# EAGLE design light_45 (EAGLE 7.6.0)
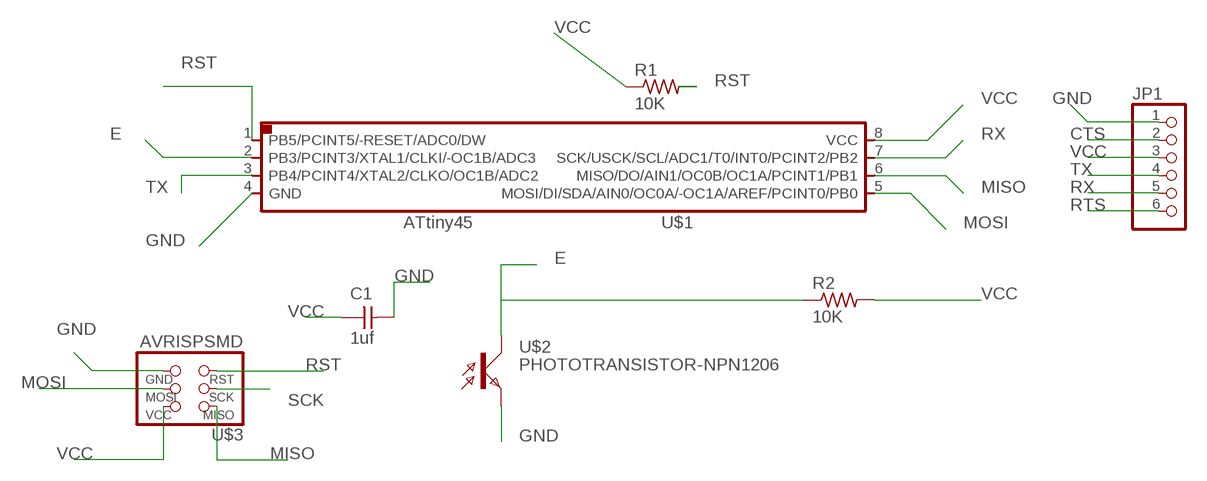
[diagram p0: schematic, sheet 1]

## Parts
C1  1uf  UNPOLARIZED_CAPACITOR1206  [1206]
JP1  PINHD-1X6B  [1X06-BIG]
R1  10K  RES-US1206FAB  [R1206FAB]
R2  10K  RES-US1206FAB  [R1206FAB]
U$1  ATTINY45SI  [SOIC8]
U$2  PHOTOTRANSISTOR-NPN1206  [OP1206]
U$3  AVRISPSMD  [2X03SMD]

## Nets
CTS: JP1.2
E: R2.1 U$1.2(PB3/PCINT3/XTAL1/CLKI/-OC1B/ADC3) U$2.COLLECTOR(C)
GND: C1.2 JP1.1 U$1.4(GND) U$2.EMITTER(E) U$3.6(GND)
MISO: U$1.6(MISO/DO/AIN1/OC0B/OC1A/PCINT1/PB1) U$3.1(MISO)
MOSI: U$1.5(MOSI/DI/SDA/AIN0/OC0A/-OC1A/AREF/PCINT0/PB0) U$3.4(MOSI)
RST: R1.2 U$1.1(PB5/PCINT5/-RESET/ADC0/DW) U$3.5(RST)
RTS: JP1.6
RX: JP1.5 U$1.7(SCK/USCK/SCL/ADC1/T0/INT0/PCINT2/PB2)
SCK: U$3.3(SCK)
TX: JP1.4 U$1.3(PB4/PCINT4/XTAL2/CLKO/OC1B/ADC2)
VCC: C1.1 JP1.3 R1.1 R2.2 U$1.8(VCC) U$3.2(VCC)

## Library data of the parts
C1 = 01_FAB_Hello:UNPOLARIZED_CAPACITOR: unpolarized_capacitor
JP1 = 01_adafruit:PINHD-1X6: PIN HEADER
R1 R2 = fab:RES-US: Resistor (US Symbol) Variants with postfix FAB are widened to allow the routing of internal traces
U$1 = 01_fab:ATTINY45
U$2 = 01_fab:PHOTOTRANSISTOR-NPN
U$3 = 01_fab:AVRISP

## Net classes
0 default: width 0.15 mm, clearance 0.5 mm

## Board
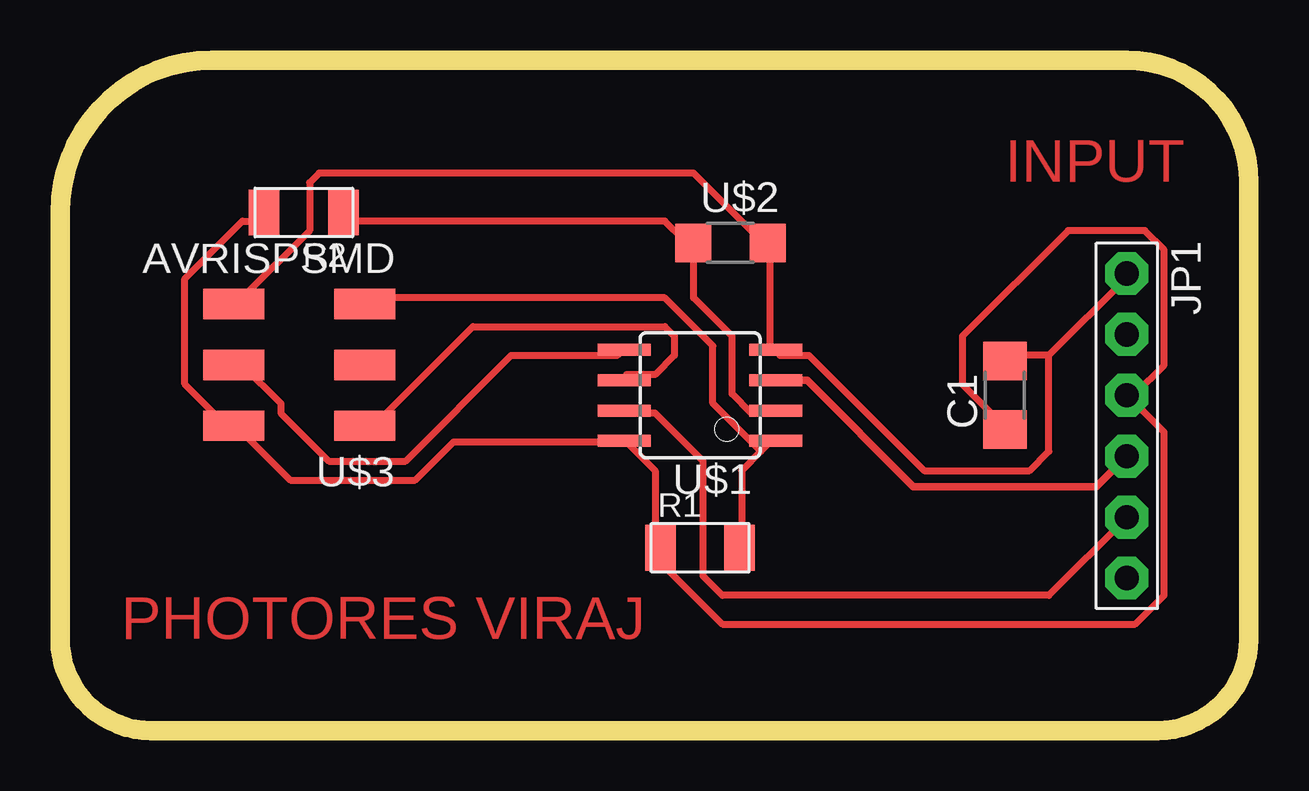
[diagram p1: board, top side]

Size 49.53 x 27.94 mm. Coordinates in mm from the lower left corner, seen from the top.
Outline: 0,21.59 arc-90 6.35,27.94 44.45,27.94 arc-90 49.53,22.86 49.53,3.81 arc-90 45.72,0 3.81,0 arc-90 0,3.81 0,21.59
Copper layers (1*16): Top 0.035mm / dielectric 1.5mm / Bottom 0.035mm
Design rules "fab": minimum track width 0.3mm, minimum drill 32mil, track to track 0.315mm, track to pad 0.315mm, pad to pad 0.315mm, via to via 0.315mm, smd to smd 0.315mm, copper to edge 40mil, drill to drill 16mil, minimum pad ring 10mil, minimum via ring 8mil, stop-mask expansion 4mil, vias tented up to drill 0mil, thermal gap 10mil

### Footprints (pad centres in the part's own frame; a part is rotated, then mirrored left to right if it is on the bottom)
1206 = smd 1.6 x 1.803: 1 -1.422,0; 2 1.422,0
1X06-BIG = drill 1.016 pad 1.778 octagon: 1 -6.35,0; 2 -3.81,0; 3 -1.27,0; 4 1.27,0; 5 3.81,0; 6 6.35,0
R1206FAB = smd 1.27 x 1.905: 1 -1.651,0; 2 1.651,0
SOIC8 = smd 0.5 x 2.2: 1 -1.905,-3.154; 2 -0.645,-3.154; 3 0.625,-3.154; 4 1.895,-3.154; 5 1.905,3.154; 6 0.635,3.154; 7 -0.635,3.154; 8 -1.905,3.154
OP1206 = smd 1.5 x 1.6: COLLECTOR -1.55,0; EMITTER 1.55,0
2X03SMD = smd 2.54 x 1.27: 1 -2.54,2.54; 2 2.92,2.54; 3 -2.54,0; 4 2.92,0; 5 -2.54,-2.54; 6 2.92,-2.54

### Placement (x,y rotation side)
C1  39.37,13.97 90 top
JP1  44.45,12.7 270 top
R1  26.67,7.62 0 top
R2  10.16,21.59 180 top
U$1  26.67,13.97 90 top
U$2  27.94,20.32 0 top
U$3  10.16,15.24 180 top

### Tracks (layer width: path | path; a pad name or v marks a point on that pad's centre or on a via)
E
  Top 0.3: U$1.2 29.6,13.23 28.8,13.23 28,14.03 28,16.43 26.4,18.03 26.4,20.03 U$2.COLLECTOR 26,20.43 25.2,21.23 12,21.23 R2.1
GND
  Top 0.3: 41.2,15.63 39.6,15.63 C1.2 | 41.2,15.63 44.4,18.83 JP1.1 | U$3.6 7.6,18.03 10.4,20.83 10.4,22.83 10.8,23.23 26.4,23.23 29.2,20.43 U$2.EMITTER 29.6,20.03 29.6,16.03 U$1.4 30,15.63 31.2,15.63 36,10.83 40.4,10.83 41.2,11.63 41.2,15.63
MISO
  Top 0.3: U$1.6 23.6,14.83 24.8,14.83 25.6,15.63 25.6,16.43 25.2,16.83 17.2,16.83 12.8,12.43 U$3.1
MOSI
  Top 0.3: U$1.5 23.2,15.63 18.8,15.63 14.4,11.23 11.2,11.23 9.2,13.23 9.2,13.63 7.6,15.23 U$3.4
RST
  Top 0.3: 29.2,11.63 29.6,12.03 U$1.1 | 29.2,11.63 28.4,10.83 28.4,7.63 R1.2 | 29.2,11.63 27.2,13.63 27.2,16.03 25.2,18.03 12.8,18.03 U$3.5
RX
  Top 0.3: U$1.7 23.6,13.23 24.8,13.23 26.8,11.23 26.8,6.43 27.6,5.63 41.2,5.63 44.4,8.83 JP1.5
TX
  Top 0.305: U$1.3 31.12,14.6 35.56,10.16 43.18,10.16 JP1.4
VCC
  Top 0.3: C1.1 39.2,12.83 37.6,14.43 37.6,16.43 42,20.83 45.2,20.83 46,20.03 46,15.23 44.8,14.03 JP1.3 44.8,13.63 46,12.43 46,5.63 44.8,4.43 27.6,4.43 24.8,7.23 R1.1 24.8,7.63 24.8,10.83 23.6,12.03 U$1.8 23.2,12.03 16.4,12.03 14.8,10.43 9.6,10.43 7.6,12.43 U$3.2 7.2,12.43 5.2,14.43 5.2,18.83 7.6,21.23 8.4,21.23 R2.2

### Text on the board
Top: INPUT | PHOTORES VIRAJ